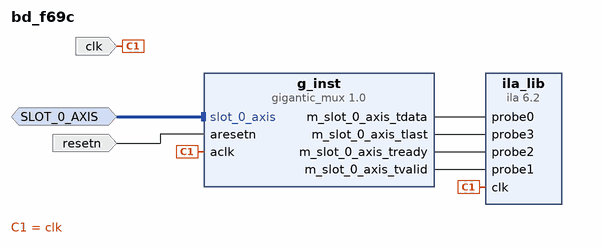
[diagram p0: block diagram of the top level]
# Vivado block design bd_f69c, xc7z020clg400-1, Vivado 2023.2
create_bd_design bd_f69c

create_bd_intf_port -mode Monitor -vlnv xilinx.com:interface:axis_rtl:1.0 SLOT_0_AXIS
create_bd_port -dir I -type clk clk
set_property -dict {CONFIG.ASSOCIATED_BUSIF SLOT_0_AXIS CONFIG.ASSOCIATED_RESET resetn} [get_bd_ports clk]
create_bd_port -dir I -type rst resetn

create_bd_cell -type ip -vlnv xilinx.com:ip:ila:6.2 ila_lib
set_property -dict [list \
  CONFIG.ALL_PROBE_SAME_MU TRUE \
  CONFIG.ALL_PROBE_SAME_MU_CNT 1 \
  CONFIG.C_ADV_TRIGGER FALSE \
  CONFIG.C_DATA_DEPTH 1024 \
  CONFIG.C_EN_STRG_QUAL 0 \
  CONFIG.C_ILA_CLK_FREQ 24000000 \
  CONFIG.C_INPUT_PIPE_STAGES 0 \
  CONFIG.C_MONITOR_TYPE Native \
  CONFIG.C_NUM_OF_PROBES 4 \
  CONFIG.C_PROBE0_TYPE 0 \
  CONFIG.C_PROBE0_WIDTH 32 \
  CONFIG.C_PROBE1_TYPE 0 \
  CONFIG.C_PROBE1_WIDTH 1 \
  CONFIG.C_PROBE2_TYPE 0 \
  CONFIG.C_PROBE2_WIDTH 1 \
  CONFIG.C_PROBE3_TYPE 0 \
  CONFIG.C_PROBE3_WIDTH 1 \
  CONFIG.C_TRIGIN_EN false \
  CONFIG.C_TRIGOUT_EN false \
  CONFIG.C_XLNX_HW_PROBE_INFO DEFAULT \
] [get_bd_cells ila_lib]
create_bd_cell -type ip -vlnv xilinx.com:ip:gigantic_mux:1.0 g_inst
set_property -dict [list \
  CONFIG.C_EN_GIGAMUX false \
  CONFIG.C_NUM_MONITOR_SLOTS 1 \
  CONFIG.C_NUM_OF_PROBES 0 \
  CONFIG.C_SLOT_0_AXIS_TDATA_WIDTH 32 \
  CONFIG.C_SLOT_0_AXIS_TDEST_WIDTH 0 \
  CONFIG.C_SLOT_0_AXIS_TID_WIDTH 0 \
  CONFIG.C_SLOT_0_AXIS_TUSER_WIDTH 0 \
  CONFIG.C_SLOT_0_AXI_PROTOCOL AXI4S \
  CONFIG.C_SLOT_0_HAS_TKEEP 0 \
  CONFIG.C_SLOT_0_HAS_TREADY 1 \
  CONFIG.C_SLOT_0_HAS_TSTRB 0 \
  CONFIG.C_SLOT_0_MON_MODE FT \
] [get_bd_cells g_inst]

# ---- connections ----

connect_bd_intf_net [get_bd_intf_ports SLOT_0_AXIS] [get_bd_intf_pins g_inst/slot_0_axis]
connect_bd_net [get_bd_ports clk] [get_bd_pins ila_lib/clk] [get_bd_pins g_inst/aclk]
connect_bd_net -net net_slot_0_axis_tdata [get_bd_pins g_inst/m_slot_0_axis_tdata] [get_bd_pins ila_lib/probe0]
connect_bd_net -net net_slot_0_axis_tlast [get_bd_pins g_inst/m_slot_0_axis_tlast] [get_bd_pins ila_lib/probe3]
connect_bd_net -net net_slot_0_axis_tready [get_bd_pins g_inst/m_slot_0_axis_tready] [get_bd_pins ila_lib/probe2]
connect_bd_net -net net_slot_0_axis_tvalid [get_bd_pins g_inst/m_slot_0_axis_tvalid] [get_bd_pins ila_lib/probe1]
connect_bd_net [get_bd_ports resetn] [get_bd_pins g_inst/aresetn]

validate_bd_design
save_bd_design
